# Altium project Node.PrjPcb
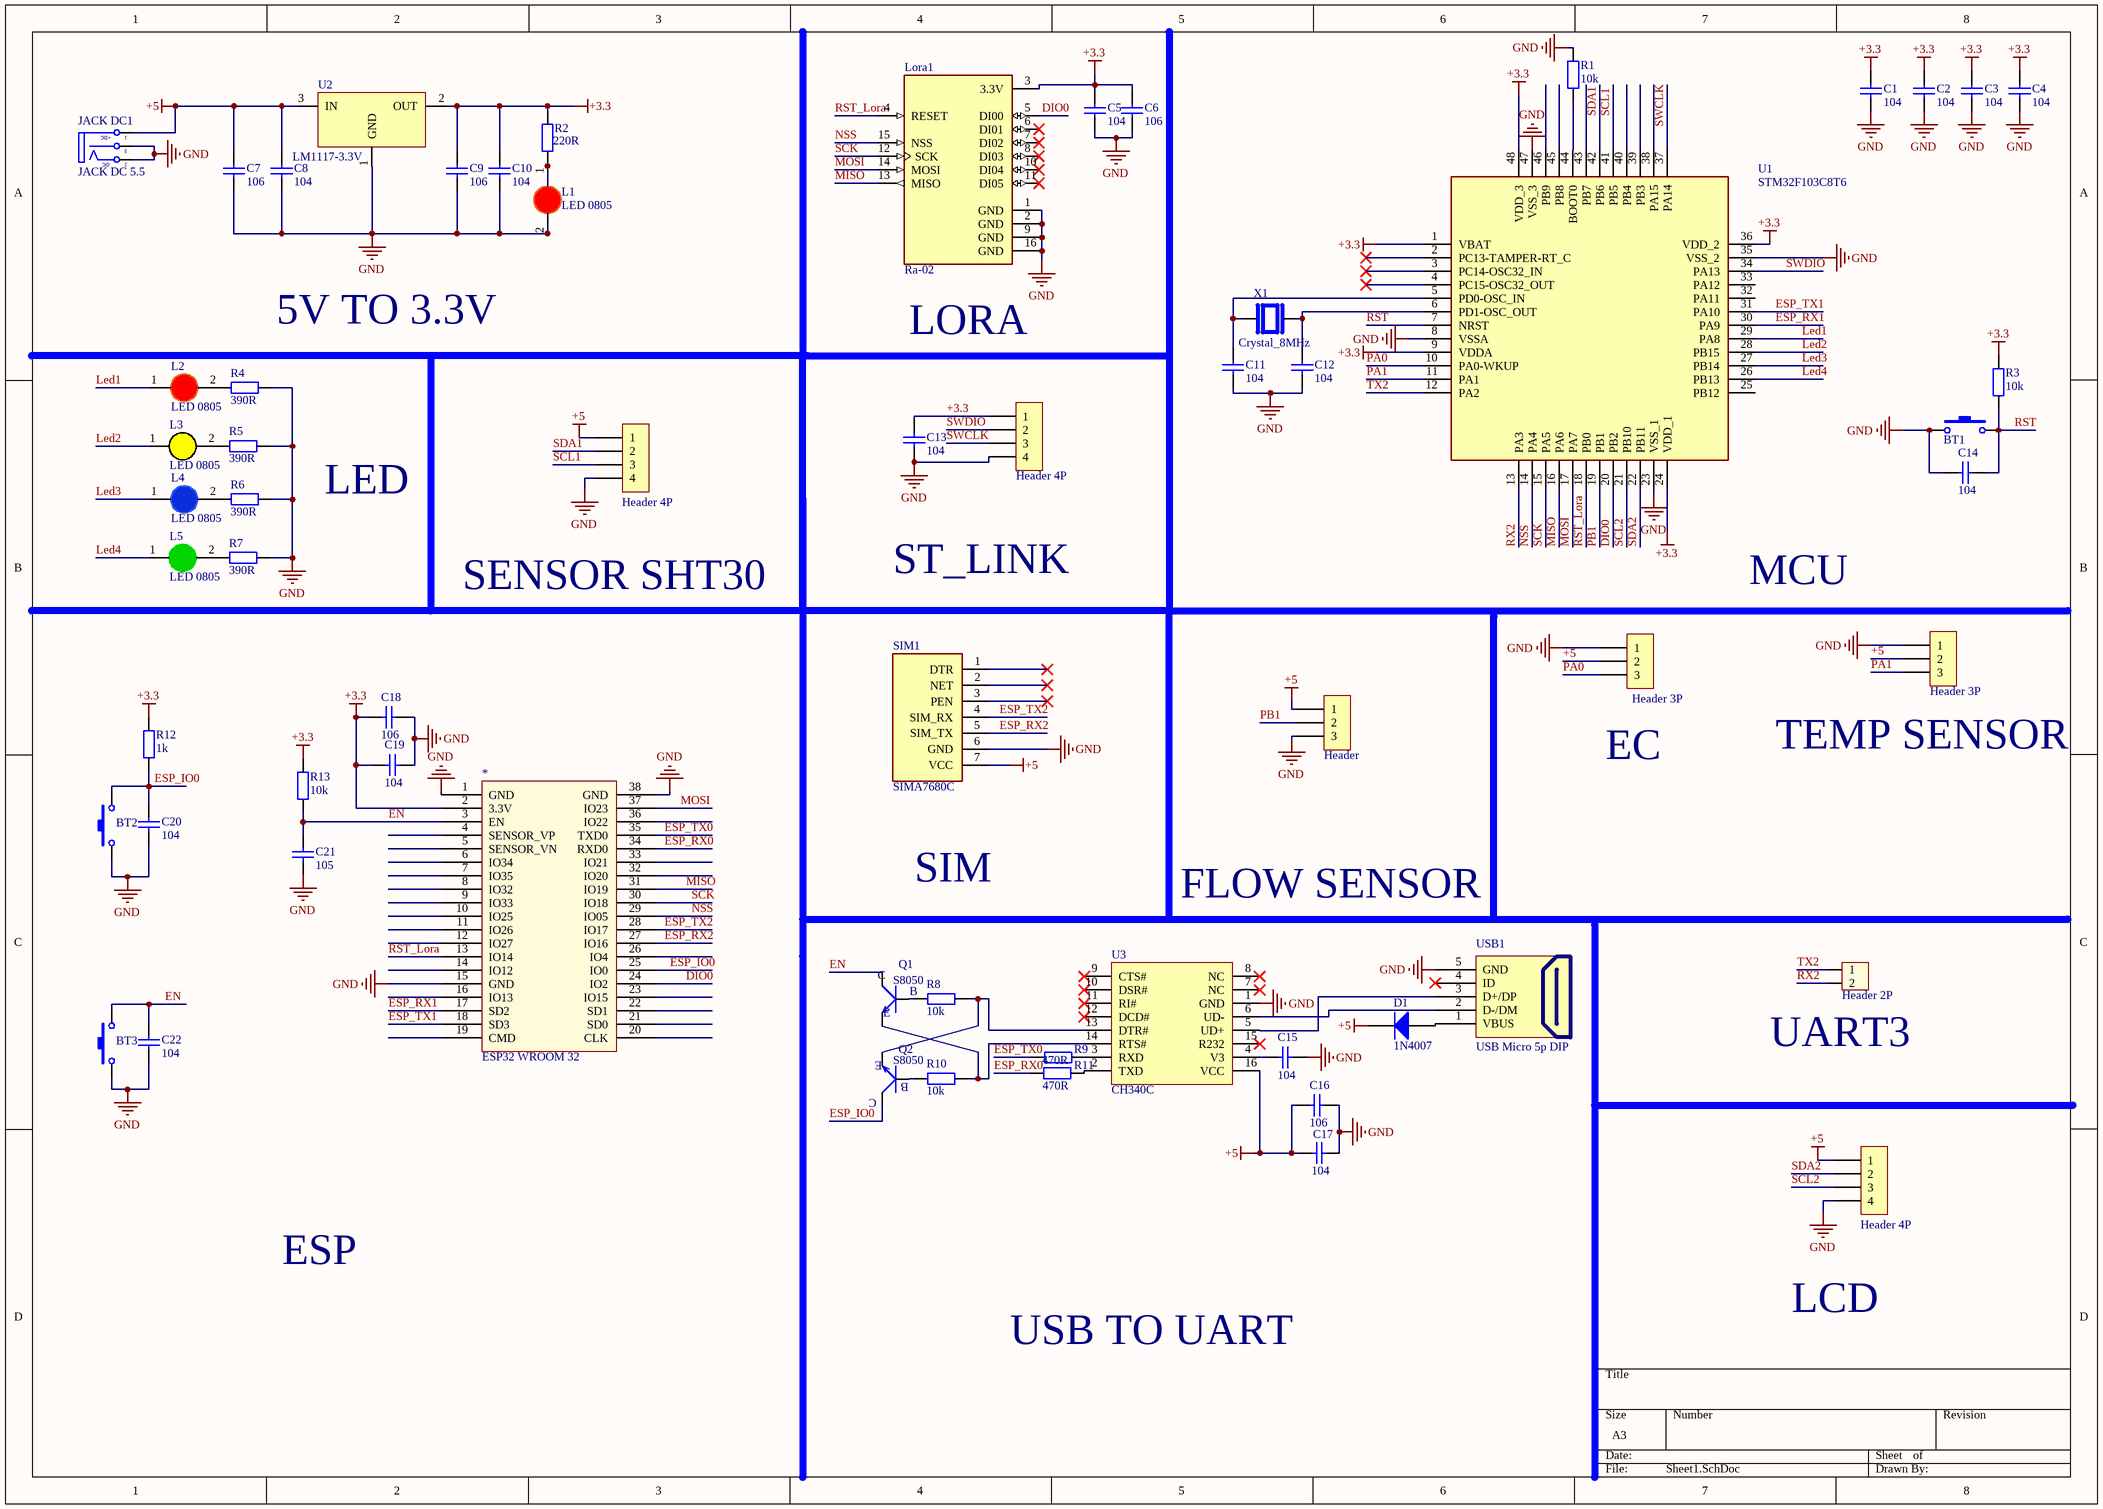
[diagram p0: Sheet1.SchDoc]
1 sheet, 62 parts. Net scope: global (net labels, ports and power ports of the same name join across sheets).
Board file: PCB1.PcbDoc

## Sheet Sheet1.SchDoc
size A3; SheetNumber: 1; SheetTotal: 1

### Parts
*  ESP32 WROOM 32  [ESP32-WROOM-32D]
BT1  Nut Nhan 2 Chan SMD 3x6x2.5  [Nut Nhan 2 Chan SMD 3x6x2.5]  (value not drawn)
BT2  Nut Nhan 2 Chan SMD 3x6x2.5  [Nut Nhan 2 Chan SMD 3x6x2.5]  (value not drawn)
BT3  Nut Nhan 2 Chan SMD 3x6x2.5  [Nut Nhan 2 Chan SMD 3x6x2.5]  (value not drawn)
C1  104  [tu 1206]
C2  104  [tu 1206]
C3  104  [tu 1206]
C4  104  [tu 1206]
C5  104  [tu 1206]
C6  106  [tu 1206]
C7  106  [tu 1206]
C8  104  [tu 1206]
C9  106  [tu 1206]
C10  104  [tu 1206]
C11  104  [tu 1206]
C12  104  [tu 1206]
C13  104  [tu 1206]
C14  104  [tu 1206]
C15  104  [tu 1206]
C16  106  [tu 1206]
C17  104  [tu 1206]
C18  106  [tu 1206]
C19  104  [tu 1206]
C20  104  [tu 1206]
C21  105  [tu 1206]
C22  104  [tu 1206]
D1  1N4007  [DIODE SMA]
H1  Header 4P  [XH2.54M-4]
H2  Header 4P  [XH2.54M-4]
H3  Header 3P  [XH2.54M-3]
H4  Header 3P  [XH2.54M-3]
H5  Header  [XH2.54M-3]
H6  Header 2P  [XH2.54M-2]
H?  Header 4P  [XH2.54M-4]
JACK_DC1  JACK DC 5.5  [JACK DC 5.5]
L1  LED 0805  [LED-1206-Red]
L2  LED 0805  [LED-1206-Red]
L3  LED 0805  [LED-1206-Yellow]
L4  LED 0805  [LED-1206-Blue]
L5  LED 0805  [LED-1206-Green]
Lora1  Ra-02  [Sx1278]
Q1  S8050  [S8050]
Q2  S8050  [S8050]
R1  10k  [tro smd 1206]
R2  220R  [tro smd 1206]
R3  10k  [tro smd 1206]
R4  390R  [Tro smd 1206]
R5  390R  [Tro smd 1206]
R6  390R  [Tro smd 1206]
R7  390R  [Tro smd 1206]
R8  10k  [tro smd 1206]
R9  470R  [tro smd 1206]
R10  10k  [tro smd 1206]
R11  470R  [tro smd 1206]
R12  1k  [tro smd 1206]
R13  10k  [tro smd 1206]
SIM1  SIMA7680C  [SIMA7680C]
U1  STM32F103C8T6  [LQFP-48_19.6_393_58X11_SMD]
U2  LM1117-3.3V  [SOT223]
U3  CH340C  [SOIC16_50_284_25X90_SMT]
USB1  USB Micro 5p DIP  [USB Micro 5p DIP]
X1  Crystal_8MHz  [XTAL_8MHz]

### Nets
+3.3: *.2(3.3V) C1.1 C2.1 C3.1 C4.1 C5.1 C6.1 C9.1 C10.1 C13.2 C18.2 C19.2 H1.1 Lora1.3(3.3V) R2.2 R3.2 R12.2 R13.2 U1.1(VBAT) U1.9(VDDA) U1.24(VDD_1) U1.36(VDD_2) U1.48(VDD_3) U2.2(OUT)
+5: C7.1 C8.1 C16.1 C17.1 D1.2(K) H2.1 H3.2 H4.2 H5.1 H?.1 JACK_DC1.1(T) SIM1.7(VCC) U2.3(IN) U3.16(VCC)
GND: *.1(GND) *.15(GND) *.38(GND) BT1.1 BT2.1 BT3.1 C1.2 C2.2 C3.2 C4.2 C5.2 C6.2 C7.2 C8.2 C9.2 C10.2 C11.2 C12.2 C13.1 C14.1 C15.2 C16.2 C17.2 C18.1 C19.1 C20.2 C21.2 C22.2 H1.4 H2.4 H3.1 H4.1 H5.3 H?.4 JACK_DC1.2(TN) JACK_DC1.3(S) L1.2(K) Lora1.1(GND) Lora1.2(GND) Lora1.9(GND) Lora1.16(GND) R1.2 R4.1 R5.2 R6.2 R7.2 SIM1.6(GND) U1.8(VSSA) U1.23(VSS_1) U1.35(VSS_2) U1.47(VSS_3) U2.1(GND) U3.1(GND) USB1.5(GND)
DIO0: *.24(IO2) Lora1.5(DI00) U1.20(PB2)
EN: *.3(EN) BT3.2 C21.1 C22.1 Q1.3(C) R13.1
ESP_IO0: *.25(IO0) BT2.2 C20.1 Q2.3(C) R12.1
ESP_RX0: *.34(RXD0) R11.1
ESP_RX1: *.17(SD2) U1.30(PA9)
ESP_RX2: *.27(IO16) SIM1.5(SIM_TX)
ESP_TX0: *.35(TXD0) R9.1
ESP_TX1: *.18(SD3) U1.31(PA10)
ESP_TX2: *.28(IO17) SIM1.4(SIM_RX)
Led1: L2.1(A) U1.29(PA8)
Led2: L3.1(A) U1.28(PB15)
Led3: L4.1(A) U1.27(PB14)
Led4: L5.1(A) U1.26(PB13)
MISO: *.31(IO19) Lora1.13(MISO) U1.16(PA6)
MOSI: *.37(IO23) Lora1.14(MOSI) U1.17(PA7)
NSS: *.29(IO05) Lora1.15(NSS) U1.14(PA4)
PA0: H4.3 U1.10(PA0-WKUP)
PA1: H3.3 U1.11(PA1)
PB1: H5.2 U1.19(PB1)
RST: BT1.2 C14.2 R3.1 U1.7(NRST)
RST_Lora: *.13(IO14) Lora1.4(RESET) U1.18(PB0)
RX2: H6.2 U1.13(PA3)
SCK: *.30(IO18) Lora1.12(SCK) U1.15(PA5)
SCL1: H2.3 U1.41(PB5)
SCL2: H?.3 U1.21(PB10)
SDA1: H2.2 U1.42(PB6)
SDA2: H?.2 U1.22(PB11)
SWCLK: H1.3 U1.37(PA14)
SWDIO: H1.2 U1.34(PA13)
TX2: H6.1 U1.12(PA2)
NetC11_1: C11.1 U1.5(PD0-OSC_IN) X1.1
NetC12_1: C12.1 U1.6(PD1-OSC_OUT) X1.2
NetC15_1: C15.1 U3.4(V3)
NetD1_1: D1.1(A) USB1.1(VBUS)
NetL1_1: L1.1(A) R2.1
NetL2_2: L2.2(K) R4.2
NetL3_2: L3.2(K) R5.1
NetL4_2: L4.2(K) R6.1
NetL5_2: L5.2(K) R7.1
NetQ1_1: Q1.1(B) R8.1
NetQ1_2: Q1.2(E) R10.2 U3.14(RTS#)
NetQ2_1: Q2.1(B) R10.1
NetQ2_2: Q2.2(E) R8.2 U3.13(DTR#)
NetR1_1: R1.1 U1.44(BOOT0)
NetR9_2: R9.2 U3.3(RXD)
NetR11_2: R11.2 U3.2(TXD)
NetU3_5: U3.5(UD+) USB1.3(D+/DP)
NetU3_6: U3.6(UD-) USB1.2(D-/DM)

Not connected (* = marked no-connect by the designer): * 4(SENSOR_VP) 5(SENSOR_VN) 6(IO34) 7(IO35) 8(IO32) 9(IO33) 10(IO25) 11(IO26) 12(IO27) 14(IO12) 16(IO13) 19(CMD) 20(CLK) 21(SD0) 22(SD1) 23(IO15) 26(IO4) 32(IO20) 33(IO21) 36(IO22); Lora1 6(DI01)* 7(DI02)* 8(DI03)* 10(DI04)* 11(DI05)*; SIM1 1(DTR)* 2(NET)* 3(PEN)*; U1 2(PC13-TAMPER-RT_C)* 3(PC14-OSC32_IN)* 4(PC15-OSC32_OUT)* 25(PB12) 32(PA11) 33(PA12) 38(PA15) 39(PB3) 40(PB4) 43(PB7) 45(PB8) 46(PB9); U3 7(NC)* 8(NC)* 9(CTS#)* 10(DSR#)* 11(RI#)* 12(DCD#)* 15(R232)*; USB1 4(ID)*

### Notes on the sheet
- 5V TO 3.3V
- (near Lora1) LORA
- LED
- ST_LINK
- SENSOR SHT30
- MCU
- (near H4) EC
- (near H3) TEMP SENSOR
- SIM
- FLOW SENSOR
- (near H6) UART3
- ESP
- LCD
- USB TO UART
- (in symbol JACK DC 5.5) +DC; -DC

### Library data of the parts
BT1-BT3 = Nut Nhan 2 Chan SMD 3x6x2.5: Ma_Hang: MH001036; Ten: Nút Nhấn 2 Chân 3x6x2.5MM SMD
C1-C5 C8 C10-C15 C17 C19 C20 C22 = Tu 1206 104 50V 20%: Dán; Don_Vi: Con; So_Chan: 2; Ten_Linh_Kien: Tụ 1206 104-0.1uF 20% 50V; Ma_Hang: MH004544; Chung_Loai: Dán; Kieu_Chan: *
C6 C7 C9 C16 C18 = Tu 1206 106 16V 20%: Dán; Don_Vi: Con; So_Chan: 2; Ten_Linh_Kien: Tụ 1206 106-10uF 20% 16V; Ma_Hang: MH004541; Chung_Loai: Dán; Kieu_Chan: *
C21 = Tu 1206 105 50V 20%: Dán; Don_Vi: Con; So_Chan: 2; Ten_Linh_Kien: Tụ 1206 105-1uF 20% 50V; Ma_Hang: MH004545; Chung_Loai: Dán; Kieu_Chan: *
D1 = Diode M7 ( 4007 ): Dán; Don_Vi: Con; Ten_Linh_Kien: Diode M7 1N4007 SMD 1A 1000V; Ma_Hang: MH000944; Chung_Loai: Dán; Ghi_Chu: *
H1 H2 H? = Header 4P 2.54 Duc Thang: Cắm; Ten_Linh_Kien: Header 4P XH2.54-4P Đực Thẳng; Don_Vi: Con; Ma_Hang: MH001285; Chung_Loai: Cắm
H3-H5 = Header 3P 2.54 Duc Thang: Cắm; Ten_Linh_Kien: Header 3P XH2.54-3P Đực Thẳng; Don_Vi: Con; Ma_Hang: MH001292; Chung_Loai: Cắm
H6 = Header 2P 2.54 Duc Thang: Cắm; Ten_Linh_Kien: Header 2P XH2.54-2P Đực Thẳng; Don_Vi: Con; Ma_Hang: MH001283; Chung_Loai: Cắm
JACK_DC1 = JACK DC 5.5: Value: Jac DC
L1 L2 = LED 1206 Do: Dán; Don_Vi: Con; Ma_Hang: MH002334; Ten_Linh_Kien: LED1206 Màu Đỏ (Red); Ghi_Chu: *; Kieu_Chan: *; Chung_Loai: Dán
L3 = LED 1206 Vang: Dán; Don_Vi: Con; Ma_Hang: MH002331; Ten_Linh_Kien: LED1206 Màu Vàng (Yellow); Ghi_Chu: *; Kieu_Chan: *; Chung_Loai: Dán
L4 = LED 1206 Xanh Duong: Dán; Don_Vi: Con; Ma_Hang: MH002333; Ten_Linh_Kien: LED1206 Màu Xanh Dương (Blue); Ghi_Chu: *; Kieu_Chan: *; Chung_Loai: Dán
L5 = LED 1206 Xanh La: Dán; Don_Vi: Con; Ma_Hang: MH002947; Ten_Linh_Kien: LED1206 Màu Xanh Lá (Green); Ghi_Chu: *; Kieu_Chan: *; Chung_Loai: Dán
Lora1 = Ra-02: Lora sx1278
Q1 Q2 = S8050: Transistor NPN
R1 R3 R13 = Tro 1206 1% 10k: Dán; Don_Vi: Con; So_Chan: 2; Ten_Linh_Kien: Trở 1206 1% 10k; Ma_Hang: MH005885; Chung_Loai: Dán; Kieu_Chan: *
R2 = Tro 1206 1% 220R: Dán; Ma_Hang: MH005897; Don_Vi: Con; So_Chan: 2; Ten_Linh_Kien: Trở 1206 1% 220R; Chung_Loai: Dán; Kieu_Chan: *
R4-R7 = Tro 1206 5% 390R: Dán; Don_Vi: Con; So_Chan: 2; Ten_Linh_Kien: Trở 1206 5% 390R; Ma_Hang: MH005927; Chung_Loai: Dán; Kieu_Chan: *
R8 R10 = Tro 1206 5% 10k: Dán; Don_Vi: Con; So_Chan: 2; Ten_Linh_Kien: Trở 1206 5% 10K; Ma_Hang: MH005909; Chung_Loai: Dán; Kieu_Chan: *
R9 R11 = Tro 1206 1% 680R: Dán; Don_Vi: Con; So_Chan: 2; Ten_Linh_Kien: Trở 1206 5% 680R; Ma_Hang: MH005901; Chung_Loai: Dán; Kieu_Chan: *
R12 = Tro 1206 5% 1k: Dán; Don_Vi: Con; So_Chan: 2; Ten_Linh_Kien: Trở 1206 5% 1k; Ma_Hang: MH005904; Chung_Loai: Dán; Kieu_Chan: *
U1 = IC_STM32F103C8T6: ARM® Cortex®-M3 STM32F1 Microcontroller IC 32-Bit 72MHz 64KB (64K x 8) FLASH 48-LQFP (7x7) /; Manufacturer: STMicroelectronics; Alternate Part Number-1: NA; Manufacturer Part Number: STM32F103C8T6; Case/Package: LQFP48; Supplier-1: LCSC; Supplier Part Number-1: STM32F103C8T6
U2 = LM1117: 800mA Low-Dropout Linear Regulator; Creator: Nguyen Ba Bien; Website: http://group3i.net
U3 = CH340C: USB Bridge, USB to UART USB 2.0 UART Interface; Manufacturer: Olimex; Alternate Part Number-1: NA; Manufacturer Part Number: CH340C; Case/Package: SOIC16; Supplier-1: LCSC; Supplier Part Number-1: C84681
USB1 = USB Micro 5p DIP: USB Type B; Ten: MicroUSB MK5P DIP; Ma_Hang: MH005145
X1 = Crystal_8MHz: 8MHz